# Altium schematic sheet sch_substrate_board_motor_driver.SchDoc
size A4; SheetNumber: 4; SheetTotal: 6
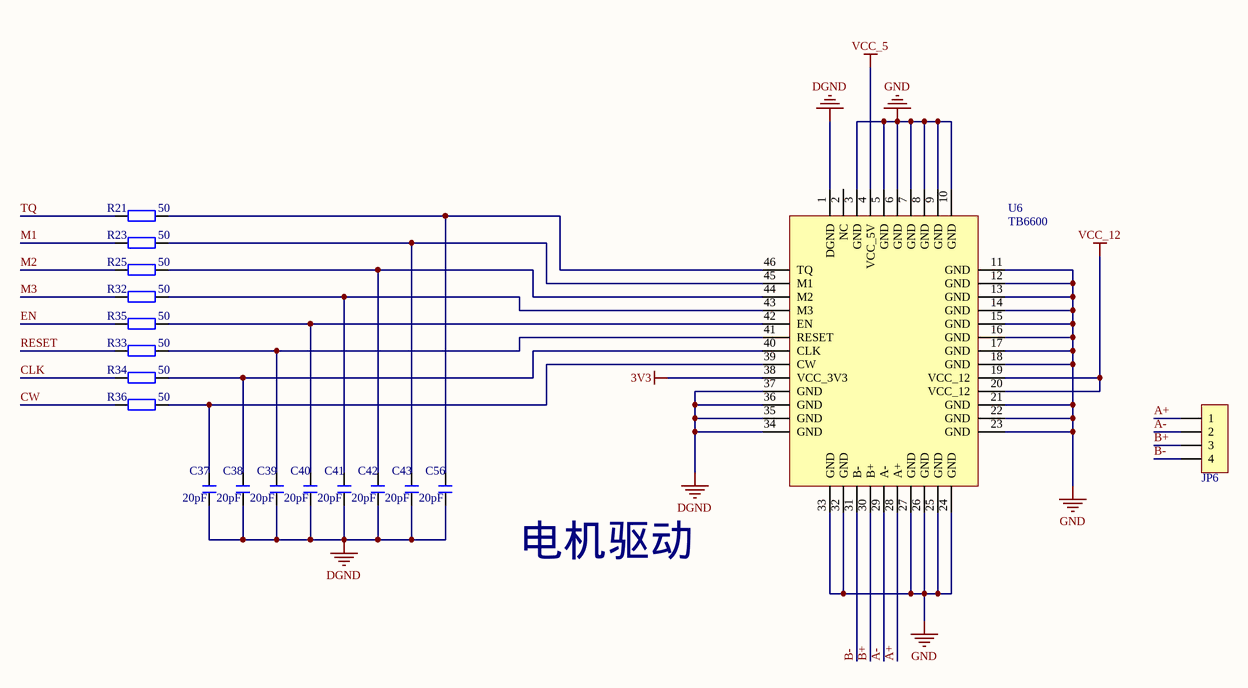
[diagram p0: sch_substrate_board_motor_driver.SchDoc]

## Parts
C37  20pF  [C 0805_L]
C38  20pF  [C 0805_L]
C39  20pF  [C 0805_L]
C40  20pF  [C 0805_L]
C41  20pF  [C 0805_L]
C42  20pF  [C 0805_L]
C43  20pF  [C 0805_L]
C56  20pF  [C 0805_L]
JP6  HDR-1X4  [KF128-3.81-4P]  (value not drawn)
R21  50  [R 0805_L]
R23  50  [R 0805_L]
R25  50  [R 0805_L]
R32  50  [R 0805_L]
R33  50  [R 0805_L]
R34  50  [R 0805_L]
R35  50  [R 0805_L]
R36  50  [R 0805_L]
U6  TB6600  [motor_drive_V2.0]

## Nets
3V3: U6.38(VCC_3V3)
DGND: C37.1 C38.1 C39.1 C40.1 C41.1 C42.1 C43.1 C56.1 U6.1(DGND) U6.34(GND) U6.35(GND) U6.36(GND) U6.37(GND)
GND: U6.3(GND) U6.5(GND) U6.6(GND) U6.7(GND) U6.8(GND) U6.9(GND) U6.10(GND) U6.11(GND) U6.12(GND) U6.13(GND) U6.14(GND) U6.15(GND) U6.16(GND) U6.17(GND) U6.18(GND) U6.21(GND) U6.22(GND) U6.23(GND) U6.24(GND) U6.25(GND) U6.26(GND) U6.27(GND) U6.32(GND) U6.33(GND)
VCC_5: U6.4(VCC_5V)
VCC_12: U6.19(VCC_12) U6.20(VCC_12)
A+: JP6.1 U6.28(A+)
A-: JP6.2 U6.29(A-)
B+: JP6.3 U6.30(B+)
B-: JP6.4 U6.31(B-)
CLK: R34.1
CW: R36.1
EN: R35.1
M1: R23.1
M2: R25.1
M3: R32.1
RESET: R33.1
TQ: R21.1
NetC37_2: C37.2 R36.2 U6.39(CW)
NetC38_2: C38.2 R34.2 U6.40(CLK)
NetC39_2: C39.2 R33.2 U6.41(RESET)
NetC40_2: C40.2 R35.2 U6.42(EN)
NetC41_2: C41.2 R32.2 U6.43(M3)
NetC42_2: C42.2 R25.2 U6.44(M2)
NetC43_2: C43.2 R23.2 U6.45(M1)
NetC56_2: C56.2 R21.2 U6.46(TQ)

Not connected (* = marked no-connect by the designer): U6 2(NC)

## Notes on the sheet
- 电机驱动

## Library data of the parts
C37-C43 C56 = C: 贴片电容; BOM名称: 无极性贴片电容; 淘宝ID: 封装库来自淘宝 ID：黄晶宝石; 联系售后，技术支持: https://shop463601444.taobao.com; 唯一出售店铺网址: https://shop463601444.taobao.com
JP6 = Header 4: 4P接插件; 版权归属: 封装库来自淘宝 ID：黄晶宝石; BOM名称: 4P接插件; 学习资源: https://shop463601444.taobao.com
R21 R23 R25 R32-R36 = R: 贴片电阻; 版权归属: 来自淘宝 ID：黄晶宝石; 封装库来自淘宝卖家 ID：黄晶宝石: 其他店铺购入均为盗版，不享受售后技术支持服务，请立即申请退款; BOM名称: 贴片电阻; 联系售后: https://item.taobao.com/item.htm?id=566775463719
U6 = Motor_Drive_V2.0: 电机驱动板